# EAGLE design src_main (EAGLE 7.2.0)
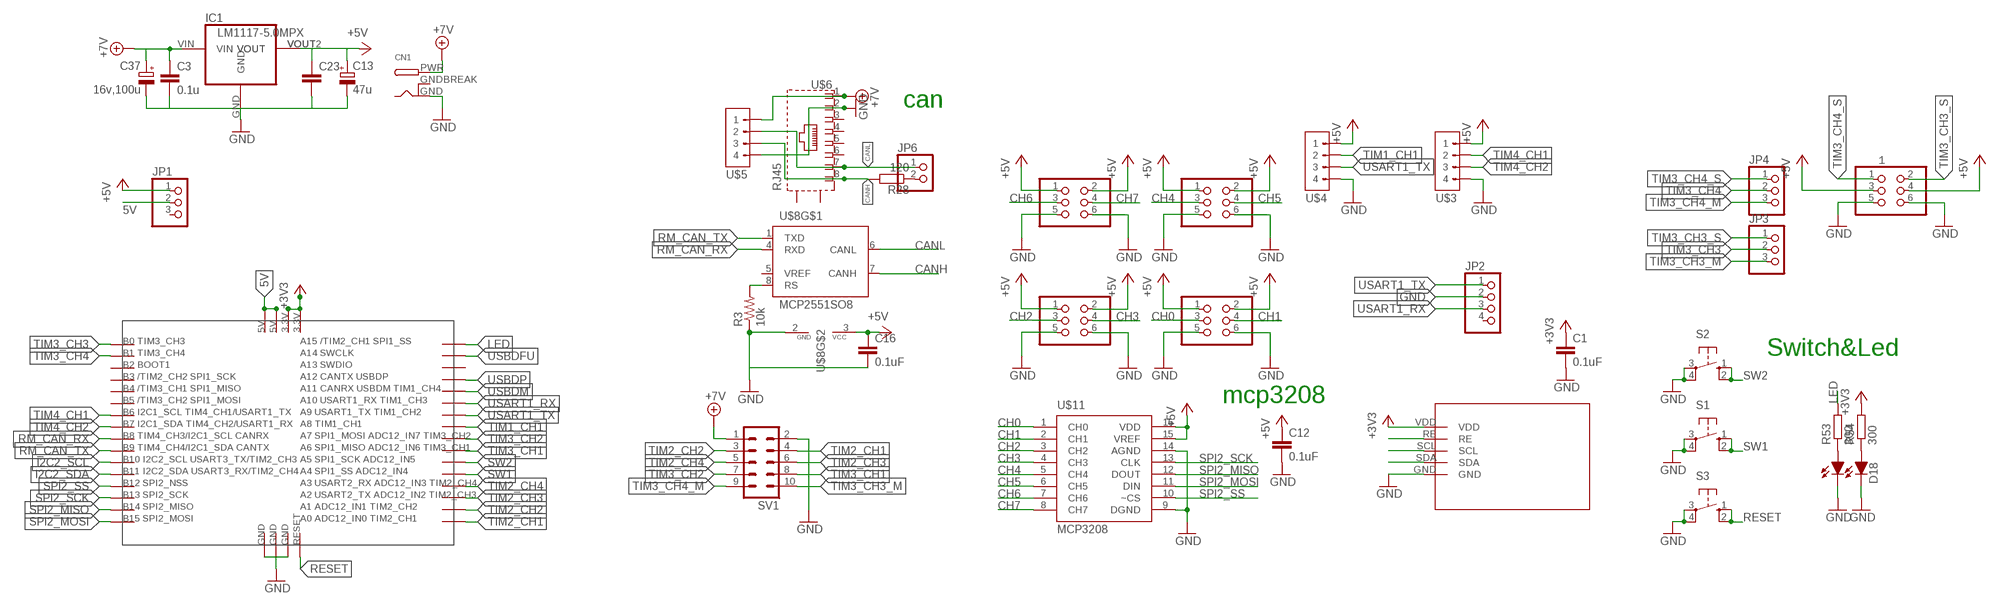
[diagram p0: schematic, sheet 1]

## Parts
C1  0.1uF  C-EUC0603  [C0603]
C3  0.1u  C-EUC0603K  [C0603K]
C12  0.1uF  C-EUC0603  [C0603]
C13  47u  CPOL-EU153CLV-0405  [153CLV-0405]
C16  0.1uF  C-EUC0603  [C0603]
C23  C-EUC0603K  [C0603K]
C37  16v,100u  CPOL-EU153CLV-0605  [153CLV-0605]
CN1  DCBARRELPTH  [DCJACK_2MM_PTH]
D18  SEC2XX4  [LED3025]
IC1  LM1117-5.0MPX  LM1117-5.0IMP  [SOT223]
JP1  PINHD-1X3  [1X03]
JP2  PINHD-1X4  [1X04]
JP3  PINHD-1X3  [1X03]
JP4  PINHD-1X3  [1X03]
JP6  PINHD-1X2  [1X02]
R3  10k  R-US_R0603  [R0603]
R28  120  R-EU_R0603  [R0603]
R53  300  R-EU_R0603  [R0603]
R54  300  R-EU_R0603  [R0603]
S1  10-XX  [B3F-10XX]
S2  10-XX  [B3F-10XX]
S3  10-XX  [B3F-10XX]
SV1  ML10L10PIN_T  [ML10L]
U$1  STBE_MINI  [STBEE_MINI]
U$2  LCD  [LCD]
U$3  S4B-XH-SM4-TB  [S4B-XH-SM4-TB]
U$4  S4B-XH-SM4-TB  [S4B-XH-SM4-TB]
U$5  S4B-XH-SM4-TB  [S4B-XH-SM4-TB]
U$6  RJ45  [LAN]
U$8  MCP2551SO8  [SO08]
U$11  MCP3208  [SO16]
　  PINHD-2X3/90  [2X03/90]
　　  PINHD-2X3/90  [2X03/90]
　　1  PINHD-2X3/90  [2X03/90]
　　　  PINHD-2X3/90  [2X03/90]
　　　　  PINHD-2X3/90  [2X03/90]

## Nets
5V: JP1.2 U$1.5V1 U$1.5V2
+3V3: C1.1 R54.2 U$1.3.3V1 U$1.3.3V2 U$2.VDD
+5V [VCC]: C12.1 C13.+ C16.1 C23.1 IC1.VOUT IC1.VOUT2(VOUT) JP1.1 U$3.1 U$4.1 U$8.3(VCC) U$11.15(VREF) U$11.16(VDD) 　.1 　.2 　　1.3 　　1.4 　　.1 　　.2 　　　.1 　　　.2 　　　　.1 　　　　.2
+7V [VCC]: C3.1 C37.+ CN1.PWR IC1.VIN SV1.1 U$5.1 U$6.1
CANH: R28.2 U$5.3 U$6.8 U$8.7(CANH)
CANL: JP6.1 U$5.2 U$6.7 U$8.6(CANL)
CH0: U$11.1(CH0) 　　　　.3
CH1: U$11.2(CH1) 　　　　.4
CH2: U$11.3(CH2) 　　　.3
CH3: U$11.4(CH3) 　　　.4
CH4: U$11.5(CH4) 　　.3
CH5: U$11.6(CH5) 　　.4
CH6: U$11.7(CH6) 　.3
CH7: U$11.8(CH7) 　.4
GND [GND]: C1.2 C3.2 C12.2 C13.- C16.2 C23.2 C37.- CN1.GND D18.1(C0) D18.2(C1) IC1.GND JP2.2 R3.1 S1.3(P) S1.4(P1) S2.3(P) S2.4(P1) S3.3(P) S3.4(P1) SV1.2 U$1.GND1 U$1.GND3 U$2.GND U$3.4 U$4.4 U$5.4 U$6.2 U$8.2(GND) U$11.9(DGND) U$11.14(AGND) 　.5 　.6 　　1.5 　　1.6 　　.5 　　.6 　　　.5 　　　.6 　　　　.5 　　　　.6
I2C2_SCL: U$1.B10 U$2.SCL
I2C2_SDA: U$1.B11 U$2.SDA
LED: R53.2 U$1.A15
N$9: R3.2 U$8.8(RS)
N$14: JP6.2 R28.1
N$43: D18.3(A1) R53.1
N$58: D18.4(A0) R54.1
RESET: S3.1(S) S3.2(S1) U$1.RESET U$2.RE
RM_CAN_RX: U$1.B8 U$8.4(RXD)
RM_CAN_TX: U$1.B9 U$8.1(TXD)
SPI2_MISO: U$1.B14 U$11.12(DOUT)
SPI2_MOSI: U$1.B15 U$11.11(DIN)
SPI2_SCK: U$1.B13 U$11.13(CLK)
SPI2_SS: U$1.B12 U$11.10(~CS)
SW1: S1.1(S) S1.2(S1) U$1.A4
SW2: S2.1(S) S2.2(S1) U$1.A5
TIM1_CH1: U$1.A8 U$4.2
TIM2_CH1: SV1.4 U$1.A0
TIM2_CH2: SV1.3 U$1.A1
TIM2_CH3: SV1.6 U$1.A2
TIM2_CH4: SV1.5 U$1.A3
TIM3_CH1: SV1.8 U$1.A6
TIM3_CH2: SV1.7 U$1.A7
TIM3_CH3: JP3.2 U$1.B0
TIM3_CH3_M: JP3.3 SV1.10
TIM3_CH3_S: JP3.1 　　1.2
TIM3_CH4: JP4.2 U$1.B1
TIM3_CH4_M: JP4.3 SV1.9
TIM3_CH4_S: JP4.1 　　1.1
TIM4_CH1: U$1.B6 U$3.2
TIM4_CH2: U$1.B7 U$3.3
USART1_RX: JP2.3 U$1.A10
USART1_TX: JP2.1 U$1.A9 U$4.3
USBDFU: U$1.A14
USBDM: U$1.A11
USBDP: U$1.A12
Unconnected: JP1.3 JP2.4 U$1.A13 U$1.B2 U$1.B3 U$1.B4 U$1.B5 U$1.GND2 U$6.3 U$6.4 U$6.5 U$6.6 U$6.P$11(S) U$6.P$12(S) U$8.5(VREF)

## Notes on the sheet
- can
- Switch&Led
- mcp3208

## Power pins joined to a net without a drawn wire
GNDBREAK: CN1.GNDBREAK

## Library data of the parts
C1 C3 C12 C16 C23 = resistor:C-EU: CAPACITOR, European symbol
C13 C37 = rcl:CPOL-EU: POLARIZED CAPACITOR, European symbol
CN1 = adafruit:DCBARREL: 2.0mm DC Barrel Jack DCJACK_2MM_PTH - Through Hole Jack (4UConnector: 05537)
D18 = SRT162-010:SEC2XX4
IC1 = Regulator:LM1117: 800mA and 1A Low Dropout (LDO) Positive Regulator 1.8V, 2.5V, 2.85V, 3.3V, 5V, and Adj
JP1 JP3 JP4 = pinhead:PINHD-1X3: PIN HEADER
JP2 = pinhead:PINHD-1X4: PIN HEADER
JP6 = pinhead:PINHD-1X2: PIN HEADER
R3 = resistor:R-US_: RESISTOR, American symbol
R28 R53 R54 = resistor:R-EU_: RESISTOR, European symbol
S1-S3 = switch-omron:10-XX: OMRON SWITCH; MPN: B3F-1000; OC_FARNELL: 176432; OC_NEWARK: 36M3542
SV1 = con-ml:ML10L: HARTING
U$1 = stbee_mini:STBE_MINI
U$2 = lcd:LCD
U$3-U$5 = S4B-XH-SM4-TB:S4B-XH-SM4-TB
U$6 = RJ45:RJ45
U$8 = can:MCP2551: CAN Tranceiver Microchip
U$11 = mcp3208:MCP3208
　 　　 　　1 　　　 　　　　 = pinhead:PINHD-2X3: PIN HEADER

## Board
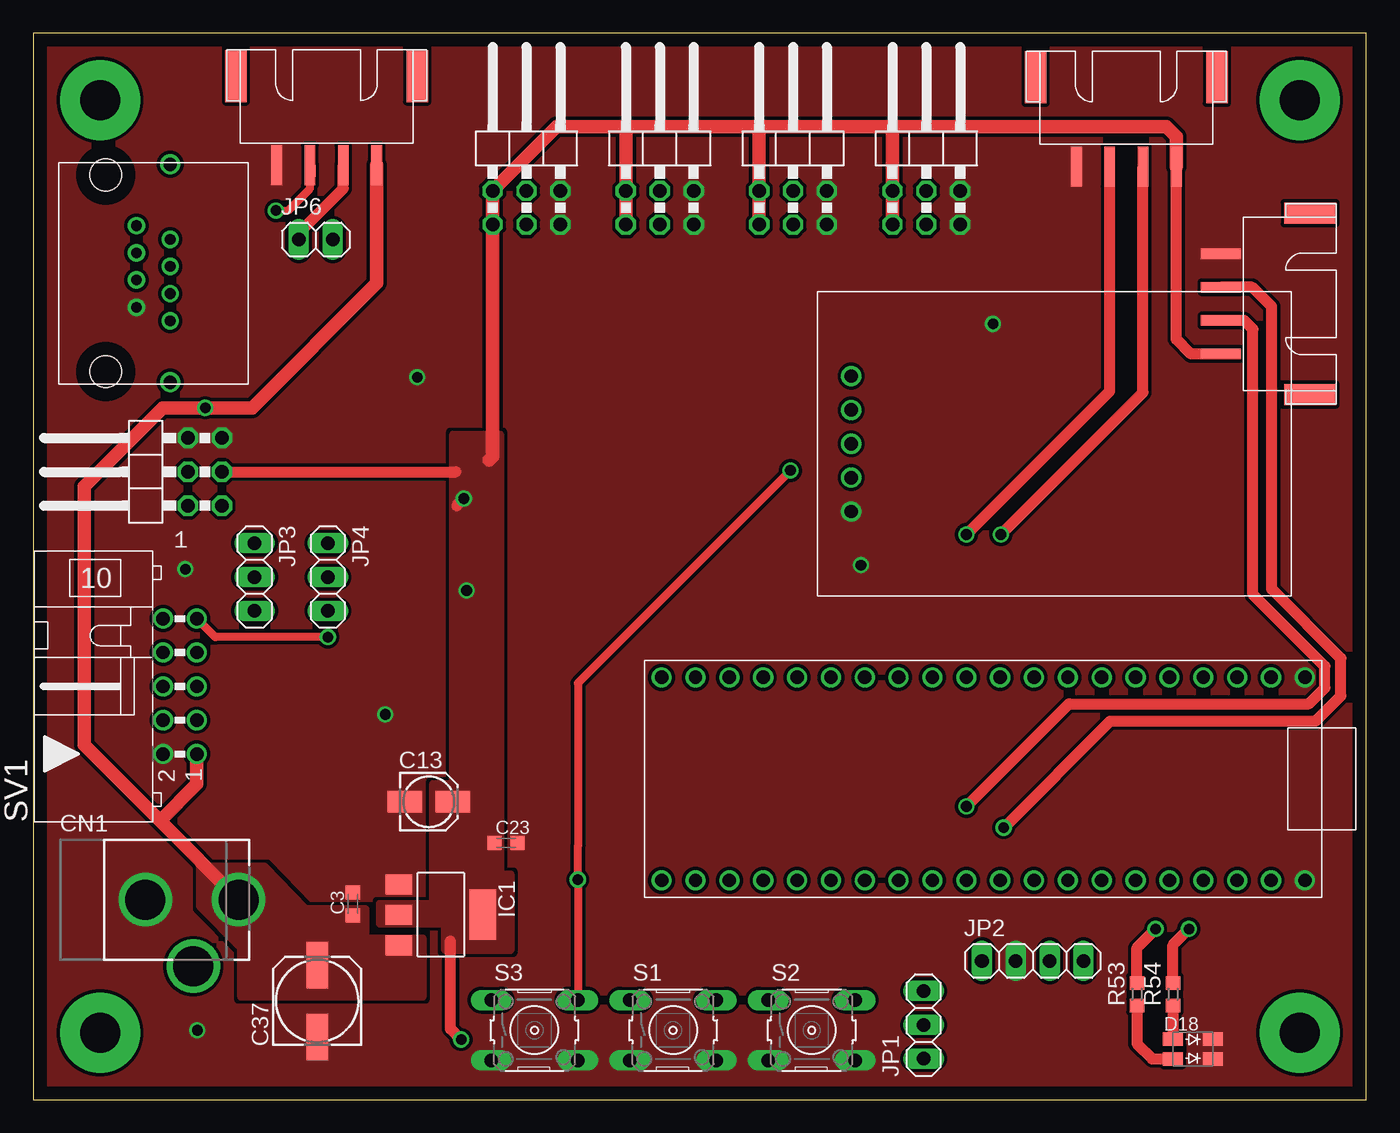
[diagram p1: board, top side]
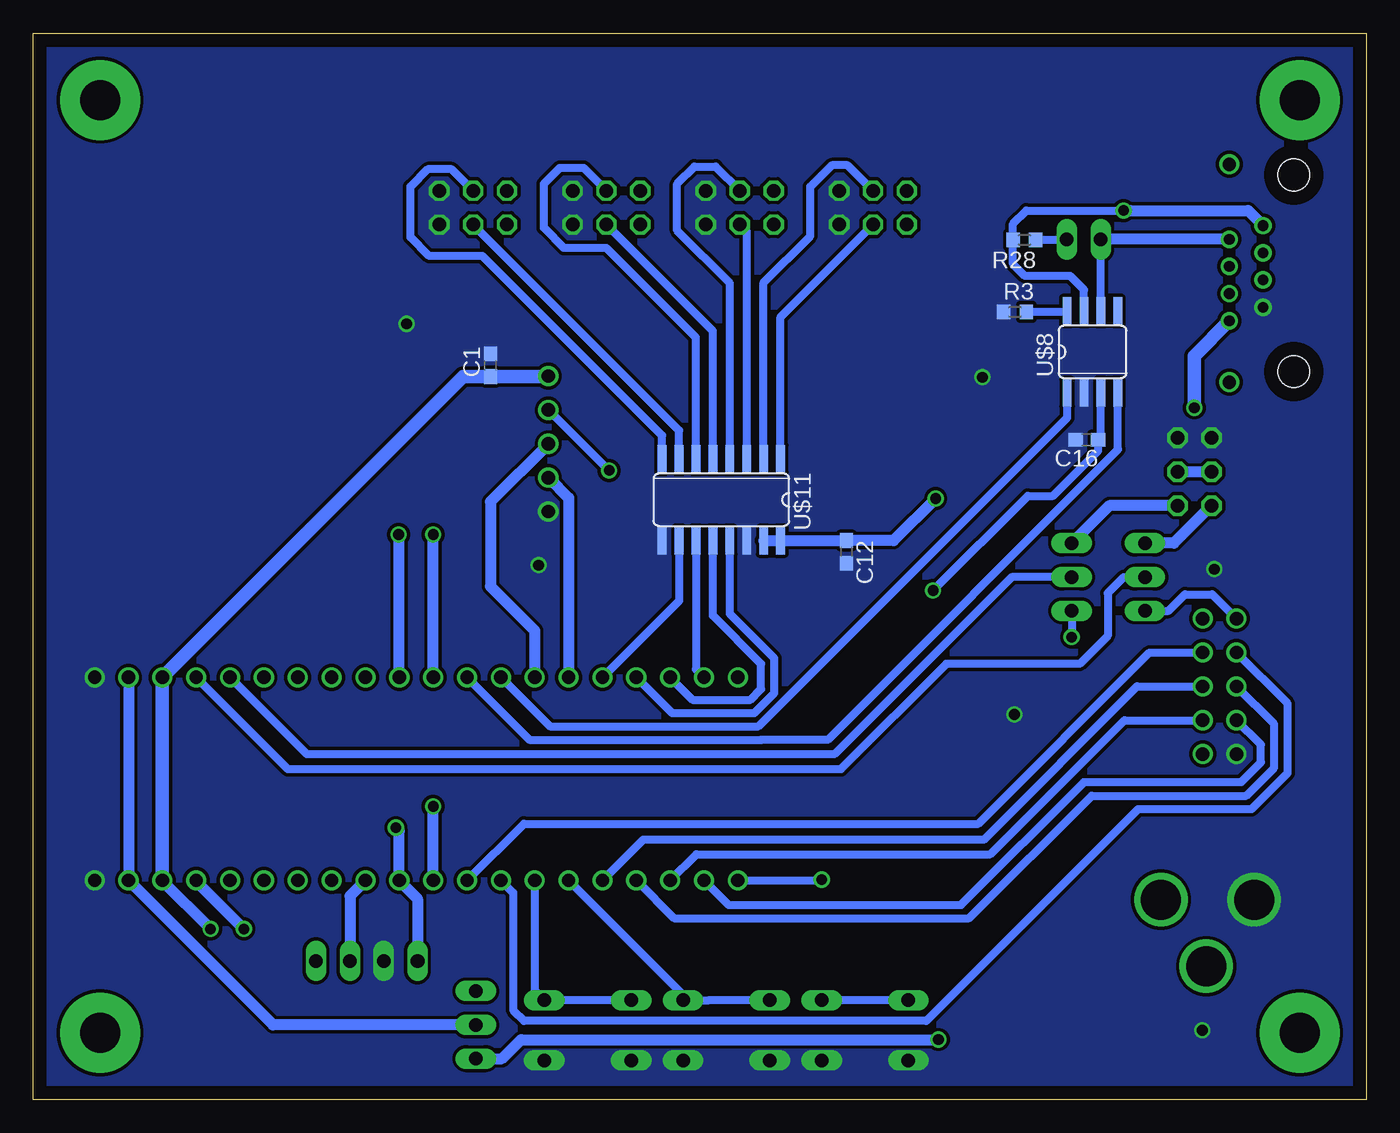
[diagram p2: board, bottom side, seen from below]

Size 100 x 80 mm. Coordinates in mm from the lower left corner, seen from the top.
Outline: 0,0 100,0 100,80 0,80 0,0
Copper layers (1*16): Top 0.035mm / dielectric 1.5mm / Bottom 0.035mm
Design rules "default *": minimum track width 16mil, minimum drill 24mil, track to track 10mil, track to pad 10mil, pad to pad 10mil, via to via 10mil, smd to smd 10mil, copper to edge 40mil, drill to drill 8mil, minimum pad ring 10mil, minimum via ring 8mil, stop-mask expansion 4mil, vias tented up to drill 0mil, thermal gap 10mil

### Footprints (pad centres in the part's own frame; a part is rotated, then mirrored left to right if it is on the bottom)
C0603 = smd 1.1 x 1: 1 -0.85,0; 2 0.85,0
C0603K = smd 1.05 x 1.08: 1 -0.875,0; 2 0.875,0
153CLV-0405 = smd 2.6 x 1.6: + 1.8,0; - -1.8,0
153CLV-0605 = smd 3.5 x 1.6: + 2.7,0; - -2.7,0
DCJACK_2MM_PTH = drill 3: GND 0,6.4; GNDBREAK 5,10; PWR 0,13.4
LED3025 = smd 1.5 x 1: 1 1.5,0.75; 2 1.5,-0.75; 3 -1.5,-0.75; 4 -1.5,0.75
SOT223 = smd 1.499 x 2.007: GND -2.261,-3.15; VIN 2.311,-3.15; VOUT 0.025,-3.15 | smd 3.81 x 2.007: VOUT2 0,3.15
1X03 = drill 1.016 long: 1 -2.54,0; 2 0,0; 3 2.54,0
1X04 = drill 1.016 long: 1 -3.81,0; 2 -1.27,0; 3 1.27,0; 4 3.81,0
1X02 = drill 1.016 long: 1 -1.27,0; 2 1.27,0
R0603 = smd 1 x 1.1: 1 -0.85,0; 2 0.85,0
B3F-10XX = drill 1.016 long: 1 -3.251,2.261; 2 3.251,2.261; 3 -3.251,-2.261; 4 3.251,-2.261
ML10L = drill 1: 1 -5.08,-1.27; 2 -5.08,1.27; 3 -2.54,-1.27; 4 -2.54,1.27; 5 0,-1.27; 6 0,1.27; 7 2.54,-1.27; 8 2.54,1.27; 9 5.08,-1.27; 10 5.08,1.27
STBEE_MINI = drill 1: 3.3V1 -7.62,19.05; 3.3V2 7.62,19.05; 5V1 -7.62,21.59; 5V2 7.62,21.59; A0 7.62,-21.59; A1 7.62,-19.05; A2 7.62,-16.51; A3 7.62,-13.97; A4 7.62,-11.43; A5 7.62,-8.89; A6 7.62,-6.35; A7 7.62,-3.81; A8 7.62,-1.27; A9 7.62,1.27; A10 7.62,3.81; A11 7.62,6.35; A12 7.62,8.89; A13 7.62,11.43; A14 7.62,13.97; A15 7.62,16.51; B0 -7.62,16.51; B1 -7.62,13.97; B2 -7.62,11.43; B3 -7.62,8.89; B4 -7.62,6.35; B5 -7.62,3.81; B6 -7.62,1.27; B7 -7.62,-1.27; B8 -7.62,-3.81; B9 -7.62,-6.35; B10 -7.62,-8.89; B11 -7.62,-11.43; B12 -7.62,-13.97; B13 -7.62,-16.51; B14 -7.62,-19.05; B15 -7.62,-21.59; GND1 -7.62,24.13; GND2 -7.62,-24.13; GND3 7.62,24.13; RESET 7.62,-24.13
LCD = drill 1: GND 2.54,6.35; RE 2.54,13.97; SCL 2.54,11.43; SDA 2.54,8.89; VDD 2.54,16.51
S4B-XH-SM4-TB = smd 0.8 x 3: 1 -3.75,7.4; 2 -1.25,7.4; 3 1.25,7.4; 4 3.75,7.4 | smd 1.6 x 3.9: P$1 -6.8,0.7; P$2 6.8,0.7
LAN = drill 0.8: 1 3.57,1.27; 2 2.55,-1.27; 3 1.53,1.27; 4 0.51,-1.27; 5 -0.51,1.27; 6 -1.53,-1.27; 7 -2.55,1.27; 8 -3.57,-1.27 | drill 1: P$11 -8.175,1.27; P$12 8.175,1.27 | hole 2.4: -7.375,-3.57; 7.375,-3.57
SO08 = smd 0.66 x 2.032: 1 -1.905,-3.073; 2 -0.635,-3.073; 3 0.635,-3.073; 4 1.905,-3.073; 5 1.905,3.073; 6 0.635,3.073; 7 -0.635,3.073; 8 -1.905,3.073
SO16 = smd 0.66 x 2.032: 1 -4.445,-3.073; 2 -3.175,-3.073; 3 -1.905,-3.073; 4 -0.635,-3.073; 5 0.635,-3.073; 6 1.905,-3.073; 7 3.175,-3.073; 8 4.445,-3.073; 9 4.445,3.073; 10 3.175,3.073; 11 1.905,3.073; 12 0.635,3.073; 13 -0.635,3.073; 14 -1.905,3.073; 15 -3.175,3.073; 16 -4.445,3.073
2X03/90 = drill 1.016 octagon: 1 -2.54,-6.35; 2 -2.54,-3.81; 3 0,-6.35; 4 0,-3.81; 5 2.54,-6.35; 6 2.54,-3.81

### Placement (x,y rotation side)
C1  65.7,55.1 90 bottom
C3  23.97,14.68 90 top
C12  39,41.09 270 bottom
C13  29.67,22.34 0 top
C16  20.96,49.5 180 bottom
C23  35.47,19.26 0 top
C37  21.3,7.4 90 top
CN1  2,15 270 top
D18  87,3.8 0 top
IC1  30.57,13.88 270 top
JP1  66.8,5.6 90 top
JP2  74.98,10.4 0 top
JP3  16.6,39.2 270 top
JP4  22.1,39.2 270 top
JP6  21.19,64.53 0 top
R3  26.34,59.1 0 bottom
R28  25.64,64.5 180 bottom
R53  82.8,7.9 90 top
R54  85.5,7.9 90 top
S1  48,5.2 0 top
S2  58.4,5.2 0 top
S3  37.6,5.2 0 top
SV1  11,31 90 top
U$1  71.27,24.06 270 top
U$2  58.82,37.77 0 top
U$3  82,77.4 180 top
U$4  96.5,59.7 90 top
U$5  22,77.5 180 top
U$6  9,62 270 top
U$8  20.53,56.1 0 bottom
U$11  48.38,45 180 bottom
　  67,72 0 top
　　  57,72 0 top
　　1  7.8,47.1 90 top
　　　  47,72 0 top
　　　　  37,72 0 top

### Tracks (layer width: path | path; a pad name or v marks a point on that pad's centre or on a via)
5V
  Bottom 0.813: JP1.2 82.02,5.6 U$1.5V2 U$1.5V1
+3V3  (via drill 0.8)
  Top 0.813: R54.2 85.5,11.6 v86.7,12.8
  Bottom 0.813: v86.7,12.8 90.32,16.42 U$1.3.3V2
  Bottom 1.016: U$1.3.3V2 U$1.3.3V1 67.75,54.25 C1.1 61.39,54.25 U$2.VDD
+5V  (via drill 0.8)
  Top 0.813: 31.76,44.56 v32.3,45.1 | U$4.1 86.85,55.95 85.75,57.05 U$3.1 | 　　1.3 31.7,47.1 | v32.1,4.5 31.3,5.3 31.3,11.9
  Top 1.016: U$3.1 85.75,72.25 85,73 64.5,73 | 64.5,73 54.4,73 | 54.4,73 44.5,73 | 44.5,73 39.27,73 　　　　.2 　　　　.1 34.46,48.26 34.2,48 | 44.5,73 44.46,72.96 　　　.2 　　　.1 | 　　.1 　　.2 54.46,72.94 54.4,73 | 　.1 　.2 64.46,72.96 64.5,73
  Bottom 0.61: v32.5,38.2 25.4,45.3 23.5,45.3 20.11,48.69 C16.1 19.89,49.72 U$8.3
  Bottom 0.813: U$11.15 U$11.16 39.01,41.93 C12.1 35.46,41.94 v32.3,45.1 | 　　1.4 　　1.3 | JP1.1 64.84,3.06 63.4,4.5 v32.1,4.5
  pour Top (no thermals): 30,23.7 35,23.7 35,16.9 35.8,16.9 35.8,11.2 30.9,11.2 30.9,13.2 26,13.2 26,14.7 30,14.7
  pour Top (no thermals): 31.5,49.9 35,49.9 35,21.6 31.5,21.6
+7V  (via drill 0.8)
  Top 1.016: U$5.1 25.75,61.25 16.4,51.9 v12.9,51.9 9.7,51.9 3.8,46 3.8,26.6 9.5,20.9 | CN1.PWR 9.5,20.9 | SV1.1 12.27,23.67 9.5,20.9
  Bottom 1.016: v12.9,51.9 12.9,55.8 U$6.1
  pour Top (no thermals): 12.5,17.5 17.3,17.5 20.4,14.3 24.9,14.3 24.9,12.1 29.2,12.1 29.2,7.7 15.6,7.7 15.6,11.4 12.5,14.5
CANH  (via drill 0.8)
  Top 0.61: v18.2,66.7 19.1,66.7 20.75,68.35 20.75,69.25
  Top 0.813: U$5.3 20.75,69.25
  Bottom 0.61: U$8.7 21.16,60.77 22.2,61.8 25.6,61.8 26.49,62.69 R28.2 26.49,65.71 25.5,66.7 17.7,66.7
  Bottom 0.813: v18.2,66.7 17.7,66.7 8.86,66.7 U$6.8
CANL
  Top 0.813: JP6.1 19.92,65.02 23.25,68.35 U$5.2
  Bottom 0.61: U$8.6 19.89,64.5 JP6.1
  Bottom 0.813: U$6.7 19.9,64.55 JP6.1
CH0
  Bottom 0.61: U$11.1 43.94,58.72 　　　　.3
CH1
  Bottom 0.61: U$11.2 45.2,61.3 41.7,64.8 41.7,68.5 40.1,70.1 38.91,70.1 　　　　.4
CH2
  Bottom 0.61: U$11.3 46.48,65.12 　　　.3
CH3
  Bottom 0.61: U$11.4 47.74,61.24 51.7,65.2 51.7,68.7 50.4,70 48.81,70 　　　.4
CH4
  Bottom 0.61: U$11.5 49.02,57.66 　　.3
CH5
  Bottom 0.61: U$11.6 50.28,57.19 57,63.9 60.2,63.9 61.7,65.4 61.7,68.7 60.5,69.9 58.71,69.9 　　.4
CH6
  Bottom 0.61: U$11.7 51.55,50.2 　.3
CH7
  Bottom 0.61: U$11.8 52.83,49.83 66.3,63.3 70.3,63.3 71.7,64.7 71.7,68.5 70.4,69.8 68.61,69.8 　.4
GND  (via drill 0.8)
  other vias: 12.3,5.2 62.1,40.1 11.4,39.8 26.4,28.9 28.8,54.2 72,58.2
  pour Top (rank 6, no thermals): -10.1,88.9 114.7,88.9 114.7,-14.8 -10.1,-14.8
  pour Bottom (rank 6, no thermals): -6.8,86.6 108.7,86.6 108.7,-10.7 -6.8,-10.7
I2C2_SCL
  Bottom 0.813: U$2.SCL 65.7,44.86 65.7,38.5 62.38,35.18 U$1.B10
I2C2_SDA
  Bottom 0.813: U$2.SDA 59.84,45.14 U$1.B11
LED  (via drill 0.8)
  Top 0.813: R53.2 82.8,11.4 v84.2,12.8
  Bottom 0.813: v84.2,12.8 87.78,16.38 U$1.A15
N$1  (via drill 3 pad 6)
  other vias: 5,75
N$2  (via drill 3 pad 6)
  other vias: 5,5
N$3  (via drill 3 pad 6)
  other vias: 95,5
N$4  (via drill 3 pad 6)
  other vias: 95,75
N$9
  Bottom 0.61: U$8.8 22.51,59.1 R3.2
N$14
  Bottom 0.61: JP6.2 22.49,64.5 R28.1
N$43
  Top 0.813: R53.1 82.8,4.2 83.95,3.05 D18.3
N$58
  Top 0.813: R54.1 D18.4
RESET  (via drill 0.8)
  Top 0.61: v56.8,47.2 40.85,31.25 40.85,19 v40.85,16.5 S3.2
  Bottom 0.61: S3.1 S3.2 | U$1.RESET 40.91,16.44 v40.85,16.5 | U$2.RE 56.82,47.2 v56.8,47.2
RM_CAN_RX
  Bottom 0.61: U$1.B8 62.78,27 45.4,27 45.3,27 40.4,27 18.62,48.77 U$8.4
RM_CAN_TX
  Bottom 0.61: U$1.B9 61.24,28 45.6,28 22.43,51.16 U$8.1
SPI2_MISO
  Bottom 0.61: U$1.B14 50.54,30 46.2,30 45.4,30.8 45.4,32.7 49.02,36.31 U$11.12
SPI2_MOSI
  Bottom 0.61: U$1.B15 50.28,32.28 U$11.11
SPI2_SCK
  Bottom 0.61: U$1.B13 52.08,29 45.9,29 44.4,30.5 44.4,33.1 47.74,36.45 U$11.13
SPI2_SS
  Bottom 0.61: U$1.B12 51.55,37.42 U$11.10
SW1
  Bottom 0.61: S1.1 49.3,7.46 50.86,7.46 | 50.86,7.46 S1.2 | U$1.A4 50.86,7.46
SW2
  Bottom 0.61: S2.1 S2.2 62.38,8.19 U$1.A5
TIM1_CH1  (via drill 0.8)
  Top 0.813: v70,22 77.7,29.7 95.7,29.7 96.9,30.9 96.9,32.5 91.5,37.9 91.5,57.8 90.85,58.45 U$4.2
  Bottom 0.813: U$1.A8 v70,22
TIM2_CH1
  Bottom 0.61: U$1.A0 47.84,14.6 30.4,14.6 21.2,23.8 9.4,23.8 7.9,25.3 7.9,26.63 SV1.4
TIM2_CH2
  Bottom 0.61: U$1.A1 50.26,18.4 28.2,18.4 18.14,28.46 SV1.3
TIM2_CH3
  Bottom 0.61: U$1.A2 51.92,13.6 29.8,13.6 20.6,22.8 9,22.8 6.9,24.9 6.9,28.17 SV1.6
TIM2_CH4
  Bottom 0.61: SV1.5 17.2,31 28.7,19.5 54.24,19.5 U$1.A3
TIM3_CH1
  Bottom 0.61: SV1.8 5.9,29.71 5.9,24.5 8.6,21.8 17.1,21.8 33,5.9 63.2,5.9 64,6.7 64,15.52 U$1.A6
TIM3_CH2
  Bottom 0.61: U$1.A7 63.2,20.7 29.1,20.7 16.26,33.54 SV1.7
TIM3_CH3
  Bottom 0.61: U$1.B0 80.9,24.8 39.4,24.8 31.5,32.7 21.5,32.7 19.4,34.8 19.4,38 18.2,39.2 JP3.2
TIM3_CH3_M
  Bottom 0.61: JP3.3 14.84,36.66 13.6,37.9 11.55,37.9 SV1.10
TIM3_CH3_S
  Bottom 0.813: 　　1.2 14.43,41.74 JP3.1
TIM3_CH4
  Bottom 0.61: JP4.2 26.6,39.2 39.9,25.9 79.46,25.9 U$1.B1
TIM3_CH4_M  (via drill 0.8)
  Top 0.61: v22.1,34.7 13.65,34.7 SV1.9
  Bottom 0.61: JP4.3 v22.1,34.7
TIM3_CH4_S
  Bottom 0.813: 　　1.1 19.28,44.56 JP4.1
TIM4_CH1  (via drill 0.8)
  Top 0.813: v72.6,42.4 83.25,53.05 U$3.2
  Bottom 0.813: U$1.B6 72.54,42.34 v72.6,42.4
TIM4_CH2  (via drill 0.8)
  Top 0.813: v70,42.4 80.75,53.15 U$3.3
  Bottom 0.813: U$1.B7 v70,42.4
USART1_RX
  Bottom 0.813: U$1.A10 76.25,15.27 JP2.3
USART1_TX  (via drill 0.8)
  Top 0.813: v72.8,20.4 80.8,28.4 96.2,28.4 98.1,30.3 98.1,33.1 92.9,38.3 92.9,59.5 91.45,60.95 U$4.3
  Bottom 0.813: JP2.1 71.17,15.07 U$1.A9 72.54,20.14 v72.8,20.4